# EAGLE design shield (EAGLE 7.2.0)
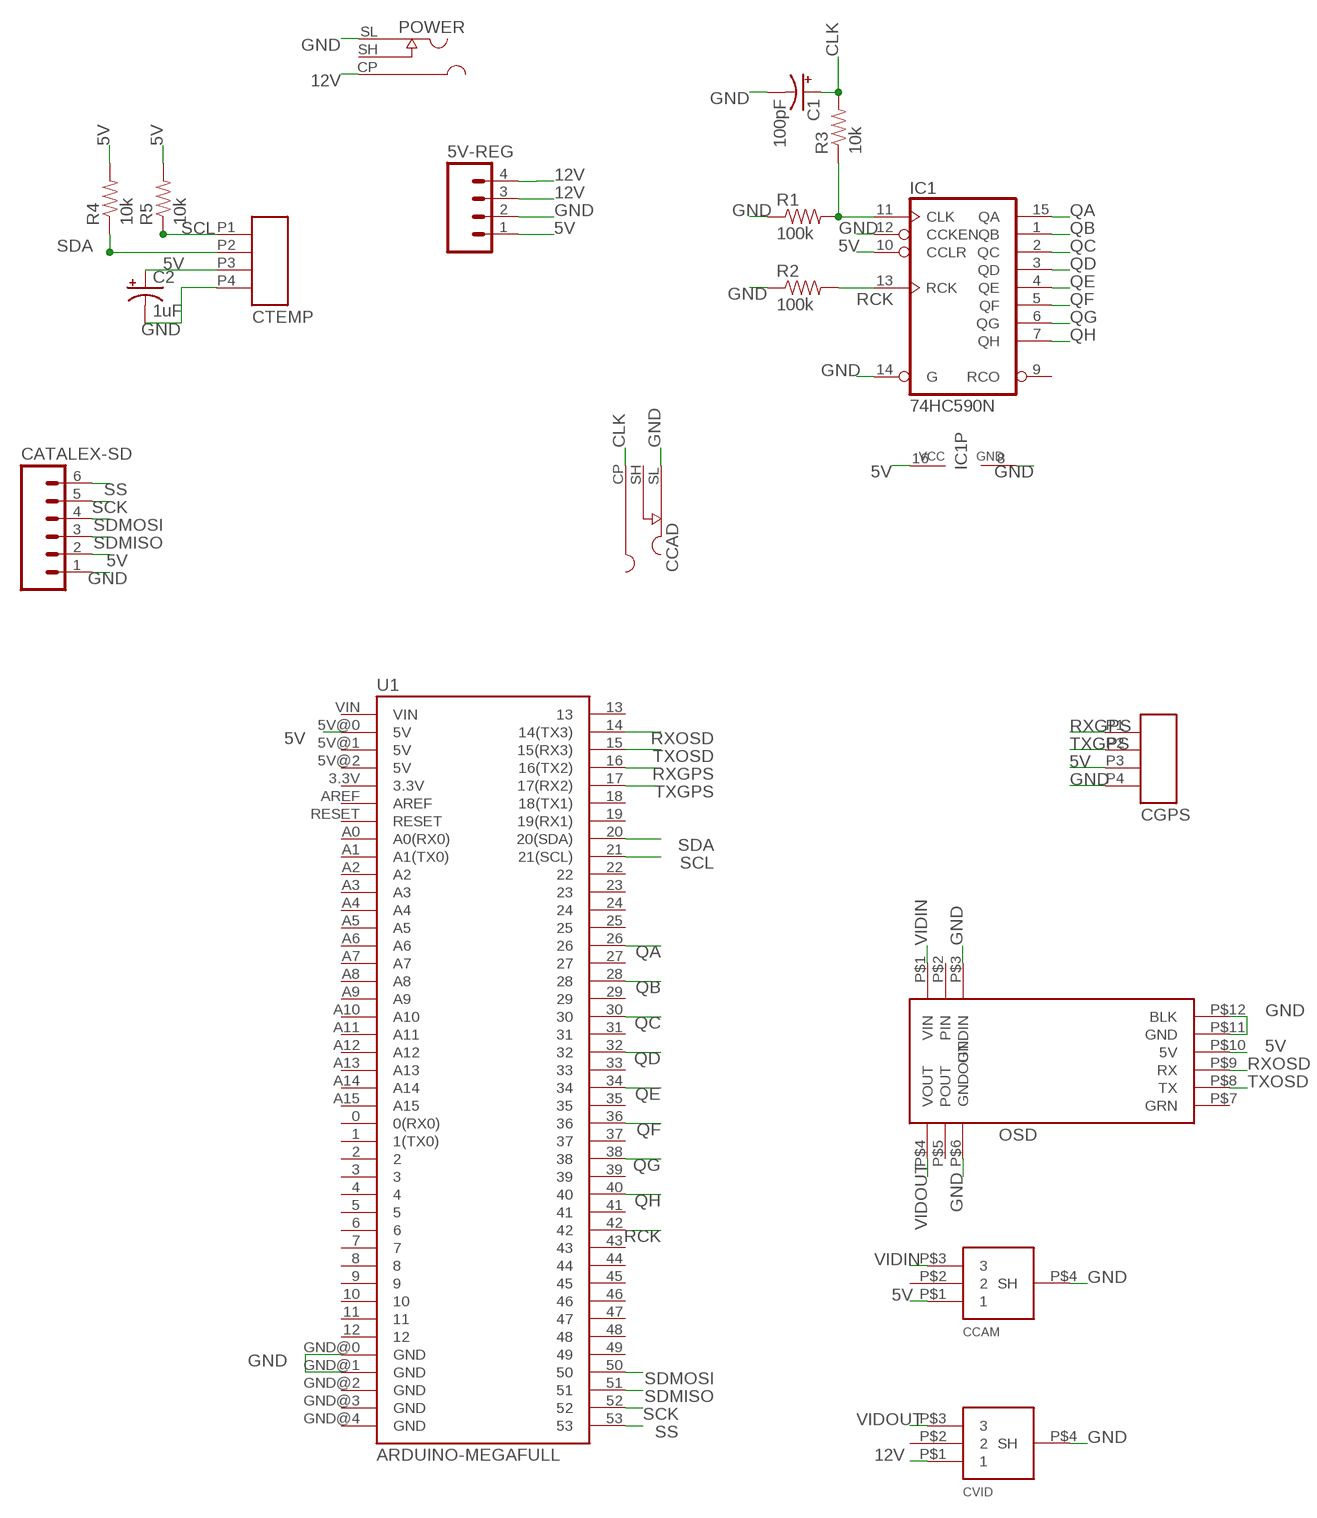
[diagram p0: schematic, sheet 1]

## Parts
5V-REG  M041.27MM  [1X04-1.27MM]
C1  100pF  10UF-25V-20%(PTH)KIT  [CPOL-RADIAL-10UF-25V-KIT]
C2  1uF  10UF-25V-20%(PTH)  [CPOL-RADIAL-10UF-25V]
CATALEX-SD  M06SILK_FEMALE_PTH  [1X06]
CCAD  L722RAS  [L722RAS]
CCAM  TRA3M  [TRA3M]
CGPS  TRAPC4MSX  [TRAPC4MSX]
CTEMP  TRAPC4MSX  [TRAPC4MSX]
CVID  TRA3M  [TRA3M]
IC1  74HC590N  [DIL16]
OSD  MINIM-OSD  [MINIM-OSD]
POWER  L722RAS  [L722RAS]
R1  100k  100KOHM-1/4W-5%(PTH)HORIZ-KIT  [AXIAL-0.3EZ]
R2  100k  100KOHM-1/4W-5%(PTH)HORIZ-KIT  [AXIAL-0.3EZ]
R3  10k  10KOHM-1/4W5%(PTH)HORIZ-KIT  [AXIAL-0.3EZ]
R4  10k  10KOHM-1/4W5%(PTH)HORIZ-KIT  [AXIAL-0.3EZ]
R5  10k  10KOHM-1/4W5%(PTH)HORIZ-KIT  [AXIAL-0.3EZ]
U1  ARDUINO-MEGAFULL  [ARDUINO_MEGA]

## Nets
5V: 5V-REG.1 C2.1(+) CATALEX-SD.2 CCAM.P$1 CGPS.P3 CTEMP.P3 IC1.10(CCLR) IC1.16(VCC) OSD.P$10(5V) R4.P$2 R5.P$2 U1.5V@0(5V)
12V: 5V-REG.3 5V-REG.4 CVID.P$1 POWER.CP(CENTRE)
CLK: C1.1(+) CCAD.CP(CENTRE) R3.P$2
GND: 5V-REG.2 C1.2(-) C2.2(-) CATALEX-SD.1 CCAD.SL(SLEEVE) CCAM.P$4(SH) CGPS.P4 CTEMP.P4 CVID.P$4(SH) IC1.8(GND) IC1.12(CCKEN) IC1.14(G) OSD.P$3(GNDIN) OSD.P$6(GNDOUT) OSD.P$11(GND) OSD.P$12(BLK) POWER.SL(SLEEVE) R1.P$1 R2.P$1 U1.GND@0(GND) U1.GND@1(GND)
N$1: IC1.11(CLK) R1.P$2 R3.P$1
QA: IC1.15(QA) U1.26
QB: IC1.1(QB) U1.28
QC: IC1.2(QC) U1.30
QD: IC1.3(QD) U1.32
QE: IC1.4(QE) U1.34
QF: IC1.5(QF) U1.36
QG: IC1.6(QG) U1.38
QH: IC1.7(QH) U1.40
RCK: IC1.13(RCK) R2.P$2 U1.42
RXGPS: CGPS.P1 U1.16(16(TX2))
RXOSD: OSD.P$9(RX) U1.14(14(TX3))
SCK: CATALEX-SD.5 U1.52
SCL: CTEMP.P1 R5.P$1 U1.21(21(SCL))
SDA: CTEMP.P2 R4.P$1 U1.20(20(SDA))
SDMISO: CATALEX-SD.3 U1.51
SDMOSI: CATALEX-SD.4 U1.50
SS: CATALEX-SD.6 U1.53
TXGPS: CGPS.P2 U1.17(17(RX2))
TXOSD: OSD.P$8(TX) U1.15(15(RX3))
VIDIN: CCAM.P$3 OSD.P$1(VIN)
VIDOUT: CVID.P$3 OSD.P$4(VOUT)
Unconnected: CCAD.SH(SHUNT) CCAM.P$2 CVID.P$2 IC1.9(RCO) OSD.P$2(PIN) OSD.P$5(POUT) OSD.P$7(GRN) POWER.SH(SHUNT) U1.0(0(RX0)) U1.1(1(TX0)) U1.2 U1.3 U1.3.3V U1.4 U1.5 U1.5V@1(5V) U1.5V@2(5V) U1.6 U1.7 U1.8 U1.9 U1.10 U1.11 U1.12 U1.13 U1.18(18(TX1)) U1.19(19(RX1)) U1.22 U1.23 U1.24 U1.25 U1.27 U1.29 U1.31 U1.33 U1.35 U1.37 U1.39 U1.41 U1.43 U1.44 U1.45 U1.46 U1.47 U1.48 U1.49 U1.A0(A0(RX0)) U1.A1(A1(TX0)) U1.A2 U1.A3 U1.A4 U1.A5 U1.A6 U1.A7 U1.A8 U1.A9 U1.A10 U1.A11 U1.A12 U1.A13 U1.A14 U1.A15 U1.AREF U1.GND@2(GND) U1.GND@3(GND) U1.GND@4(GND) U1.RESET U1.VIN

## Library data of the parts
5V-REG = SparkFun-Connectors:M04: Header 4 Standard 4-pin 0.1" header. Use with straight break away headers (SKU : PRT-00116), right angle break away headers (PRT-00553), swiss pins (PRT-00743), machine pins (PRT-00117), and female headers (PRT-00115). Molex polarized connector foot print use with SKU : PRT-08231 with associated crimp pins and housings. 1MM SMD Version SKU: PRT-10208
C1 C2 = SparkFun-Capacitors:10UF-25V-20%(PTH): CAP-08440; PROD_ID: CAP-08440
CATALEX-SD = SparkFun-Connectors:M06: Header 6 Standard 6-pin 0.1" header. Use with straight break away headers (SKU : PRT-00116), right angle break away headers (PRT-00553), swiss pins (PRT-00743), machine pins (PRT-00117), and female headers (PRT-00115). Molex polarized connector foot print use with SKU : PRT-08094 with associated crimp pins and housings. NOTES ON THE VARIANTS LOCK and LOCK_LONGPADS... This footprint was designed to help hold the alignment of a through-hole component (i.e. 6-pin header) while soldering it into place. You may notice that each hole has been shifted either up or down by 0.005 of an inch from it's more standard position (which is a perfectly straight line). This slight alteration caused the pins (the squares in the middle) to touch the edges of the holes. Because they are alternating, it causes a "brace" to hold the component in place. 0.005 has proven to be the perfect amount of "off-center" position when using our standard breakaway headers. Although looks a little odd when you look at the bare footprint, once you have a header in there, the alteration is very hard to notice. Also,if you push a header all the way into place, it is covered up entirely on the bottom side. This idea of altering the position of holes to aid alignment will be further integrated into the Sparkfun Library for other footprints. It can help hold any component with 3 or more connection pins.; PROD_ID: CONN-08437
CCAD POWER = custom-parts:L722RAS
CCAM CVID = custom-parts:TRA3M
CGPS CTEMP = custom-parts:TRAPC4MSX
IC1 = 74xx-eu:74*590: 8-bit binary COUNTER, output register
OSD = custom-parts:MINIM-OSD
R1 R2 = SparkFun-Resistors:100KOHM-1/4W-5%(PTH): RES-10686; PROD_ID: RES-10686
R3-R5 = SparkFun-Resistors:10KOHM-1/4W5%(PTH): RES-09435; PROD_ID: RES-9435
U1 = custom-parts:ARDUINO-MEGA: Arduino Mega board footprint

## Board
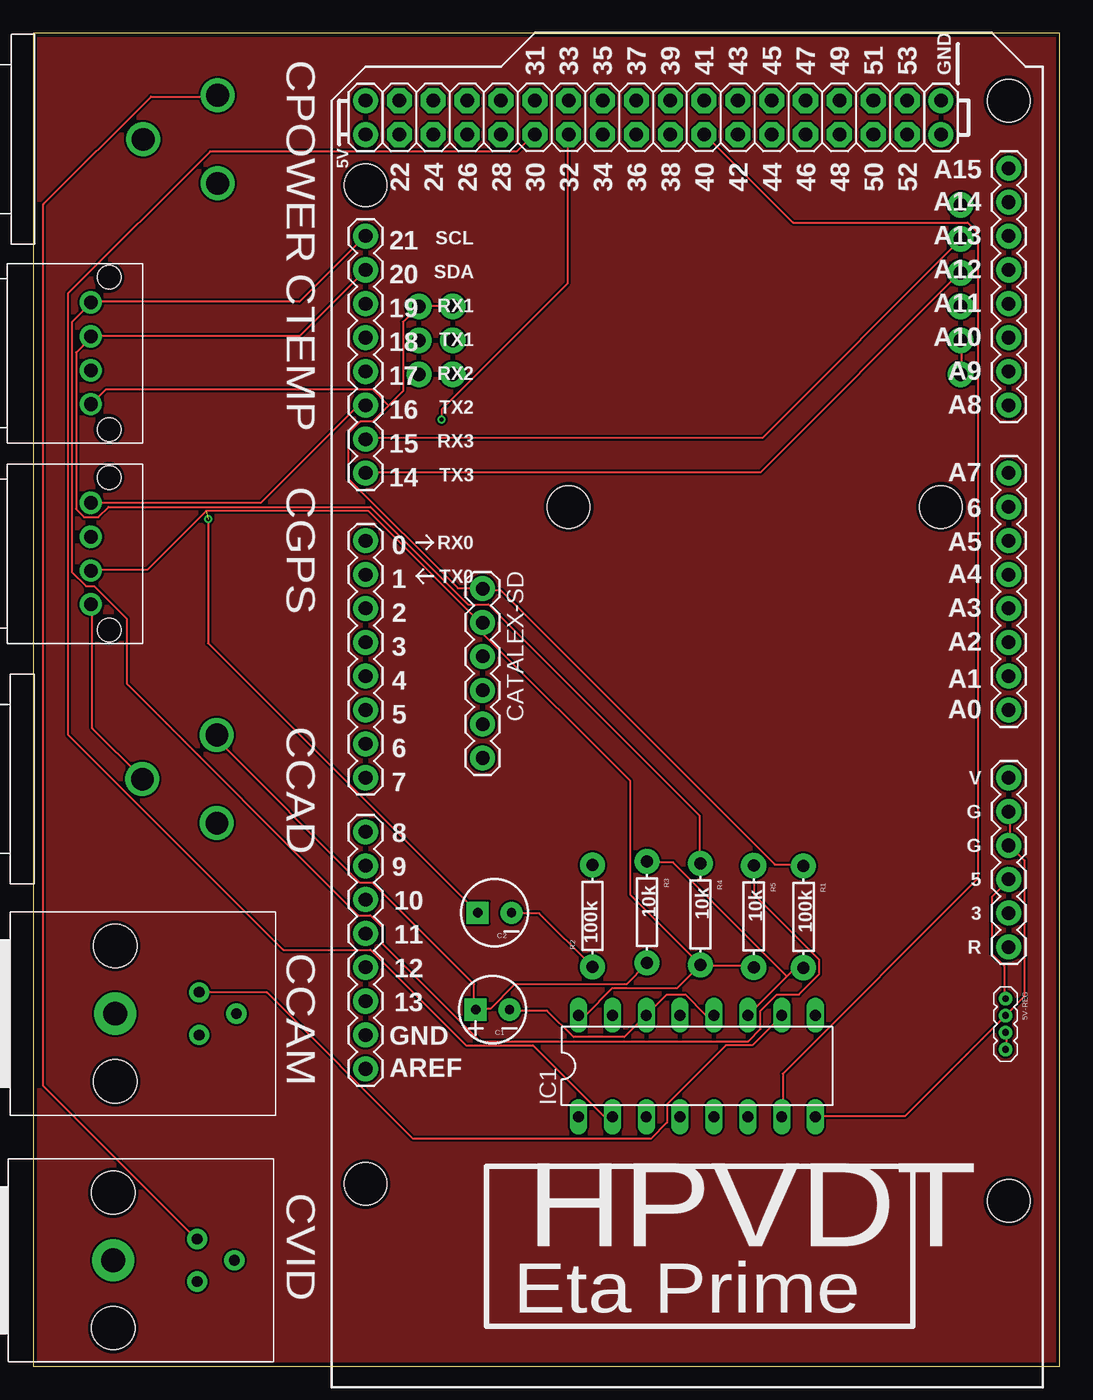
[diagram p1: board, top side]
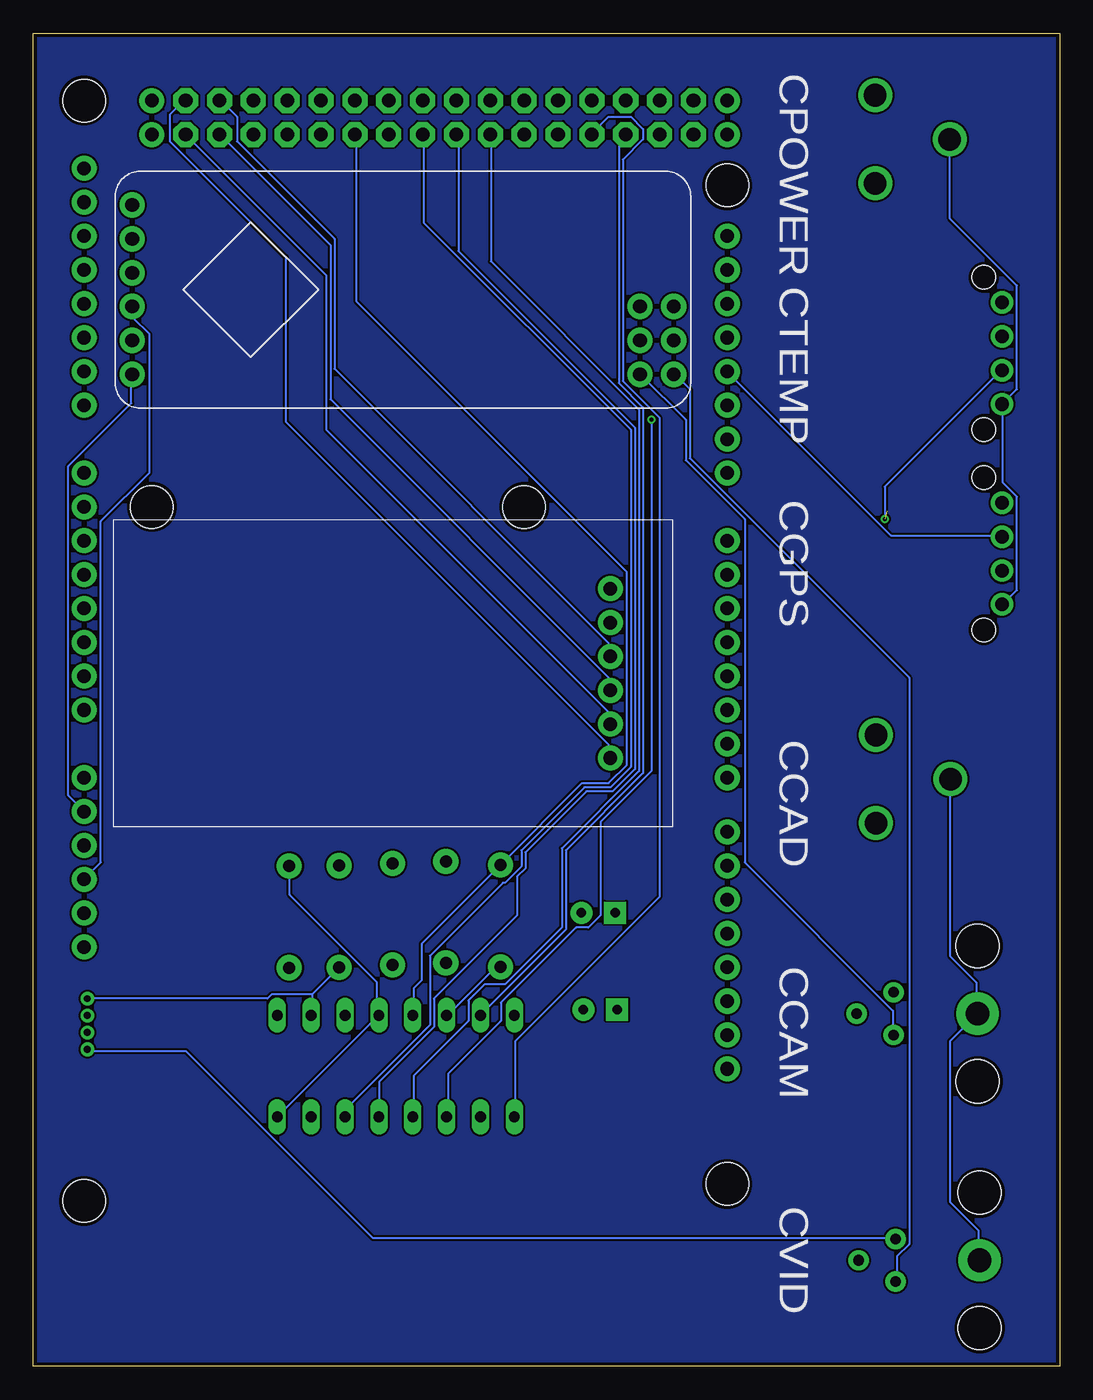
[diagram p2: board, bottom side, seen from below]

Size 77 x 100 mm. Coordinates in mm from the lower left corner, seen from the top.
Outline: 0,0 77,0 77,100 0,100 0,0
Copper layers (1*16): Top 0.035mm / dielectric 1.5mm / Bottom 0.035mm
Design rules "SeeedStudio_2layer_DRU_no_angle_20140221": minimum track width 6mil, minimum drill 12mil, track to track 6mil, track to pad 6mil, pad to pad 6mil, via to via 6mil, smd to smd 0mil, copper to edge 10mil, drill to drill 10mil, minimum pad ring 10mil, minimum via ring 6mil, stop-mask expansion 2mil, vias tented up to drill 100mil, thermal gap 10mil

### Footprints (pad centres in the part's own frame; a part is rotated, then mirrored left to right if it is on the bottom)
1X04-1.27MM = drill 0.508 pad 1: 1 0,0; 2 1.27,0; 3 2.54,0; 4 3.81,0
CPOL-RADIAL-10UF-25V-KIT = drill 0.7 pad 1.651 square: 1 1.27,0 | drill 0.7 pad 1.651: 2 -1.27,0
CPOL-RADIAL-10UF-25V = drill 0.7 pad 1.651 square: 1 1.27,0 | drill 0.7 pad 1.651: 2 -1.27,0
1X06 = drill 1.016 pad 1.88: 1 0,0; 2 2.54,0; 3 5.08,0; 4 7.62,0; 5 10.16,0; 6 12.7,0
L722RAS = drill 1.7: CP 5.588,3.302; SH 5.588,-3.302; SL 0,0
TRA3M = drill 0.8 pad 1.524: P$1 0,-1.6; P$2 -2.794,0; P$3 0,1.6 | drill 1.778 pad 3.175: P$4 6.299,0 | hole 3.251: 6.299,5.08; 6.299,-5.08
TRAPC4MSX = drill 1.016 pad 1.676: P1 3.81,0; P2 1.27,0; P3 -1.27,0; P4 -3.81,0 | hole 1.778: -5.715,-1.372; 5.715,-1.372
DIL16 = drill 0.813 long: 1 -8.89,-3.81; 2 -6.35,-3.81; 3 -3.81,-3.81; 4 -1.27,-3.81; 5 1.27,-3.81; 6 3.81,-3.81; 7 6.35,-3.81; 8 8.89,-3.81; 9 8.89,3.81; 10 6.35,3.81; 11 3.81,3.81; 12 1.27,3.81; 13 -1.27,3.81; 14 -3.81,3.81; 15 -6.35,3.81; 16 -8.89,3.81
MINIM-OSD = drill 1.016 pad 1.905: P$1 39.37,2.54; P$2 39.37,5.08; P$3 39.37,7.62; P$4 41.91,2.54; P$5 41.91,5.08; P$6 41.91,7.62; P$7 1.27,15.24; P$8 1.27,12.7; P$9 1.27,10.16; P$10 1.27,7.62; P$11 1.27,5.08; P$12 1.27,2.54
AXIAL-0.3EZ = drill 0.9 pad 1.88: P$1 -3.81,0; P$2 3.81,0
ARDUINO_MEGA = drill 1.016 pad 1.88: 0 63.5,50.8; 1 60.96,50.8; 2 58.42,50.8; 3 55.88,50.8; 3.3V 35.56,2.54; 4 53.34,50.8; 5 50.8,50.8; 5V@0 38.1,2.54; 5V@1 93.98,50.8; 5V@2 96.52,50.8; 6 48.26,50.8; 7 45.72,50.8; 8 41.656,50.8; 9 39.116,50.8; 10 36.576,50.8; 11 34.036,50.8; 12 31.496,50.8; 13 28.956,50.8; 14 68.58,50.8; 15 71.12,50.8; 16 73.66,50.8; 17 76.2,50.8; 18 78.74,50.8; 19 81.28,50.8; 20 83.82,50.8; 21 86.36,50.8; A0 50.8,2.54; A1 53.34,2.54; A2 55.88,2.54; A3 58.42,2.54; A4 60.96,2.54; A5 63.5,2.54; A6 66.04,2.54; A7 68.58,2.54; A8 73.66,2.54; A9 76.2,2.54; A10 78.74,2.54; A11 81.28,2.54; A12 83.82,2.54; A13 86.36,2.54; A14 88.9,2.54; A15 91.44,2.54; AREF 23.876,50.8; GND@0 40.64,2.54; GND@1 43.18,2.54; GND@2 93.98,7.62; GND@3 96.52,7.62; GND@4 26.416,50.8; RESET 33.02,2.54; VIN 45.72,2.54 | drill 1.016 pad 1.88 octagon: 22 93.98,48.26; 23 96.52,48.26; 24 93.98,45.72; 25 96.52,45.72; 26 93.98,43.18; 27 96.52,43.18; 28 93.98,40.64; 29 96.52,40.64; 30 93.98,38.1; 31 96.52,38.1; 32 93.98,35.56; 33 96.52,35.56; 34 93.98,33.02; 35 96.52,33.02; 36 93.98,30.48; 37 96.52,30.48; 38 93.98,27.94; 39 96.52,27.94; 40 93.98,25.4; 41 96.52,25.4; 42 93.98,22.86; 43 96.52,22.86; 44 93.98,20.32; 45 96.52,20.32; 46 93.98,17.78; 47 96.52,17.78; 48 93.98,15.24; 49 96.52,15.24; 50 93.98,12.7; 51 96.52,12.7; 52 93.98,10.16; 53 96.52,10.16 | hole 3.2: 15.24,50.8; 13.97,2.54; 66.04,35.56; 66.04,7.62; 90.17,50.8; 96.52,2.54

### Placement (x,y rotation side)
5V-REG  72.95,27.58 270 top
C1  34.46,26.75 180 top
C2  34.61,34.02 180 top
CATALEX-SD  33.71,58.33 270 top
CCAD  8.18,44.05 0 top
CCAM  12.44,26.45 180 top
CGPS  4.31,60.96 90 top
CTEMP  4.31,75.99 90 top
CVID  12.29,7.94 180 top
IC1  49.8,22.52 0 top
OSD  70.85,71.88 0 bottom
POWER  8.24,92.05 0 top
R1  57.79,33.71 270 top
R2  41.95,33.78 90 top
R3  46.05,34.06 270 top
R4  50.05,33.9 270 top
R5  54.05,33.74 270 top
U1  75.73,-1.57 90 top

### Tracks (layer width: path | path; a pad name or v marks a point on that pad's centre or on a via)
5V  (via drill 0.3)  (1 unrouted)
  Top 0.152: 5V-REG.1 72.85,27.58 72.85,30.02 71.93,30.94 71.93,35.2 73.15,36.42 U1.5V@0 | CGPS.P3 4.42,59.74 8.53,59.74 12.95,64.16 25.15,64.16 33.38,55.93 33.68,55.93 CATALEX-SD.2 33.83,55.78 33.83,54.86 44.81,43.89 44.81,35.36 49.99,30.18 R4.P$2 | IC1.16 41,26.36 41.45,26.36 43.43,28.35 48.31,28.35 49.99,30.02 R4.P$2 | CCAM.P$1 12.5,28.04 17.53,28.04 28.5,17.07 46.33,17.07 47.55,18.29 47.55,19.66 51.97,24.08 53.95,24.08 56.08,26.21 IC1.10 | R4.P$2 50.14,30.02 53.95,30.02 R5.P$2 | v13.11,63.55 13.11,54.25 33.22,34.14 C2.1
  Bottom 0.152: OSD.P$10 69.49,79.4 69.49,78.64 68.28,77.42 68.28,67.06 71.93,63.4 71.93,37.8 73.15,36.58 U1.5V@0 | 56.08,27.89 56.08,26.36 IC1.10 | 56.08,27.89 54.1,29.87 R5.P$2 | 56.08,27.89 59.13,27.89 59.44,27.58 72.85,27.58 5V-REG.1 | v13.11,63.55 13.11,65.99 4.42,74.68 CTEMP.P3
12V
  Top 0.152: 5V-REG.4 73,23.77 73,24.99 5V-REG.3 | POWER.CP 13.72,95.25 8.84,95.25 0.76,87.17 0.76,21.03 12.19,9.6 CVID.P$1
  Bottom 0.152: 5V-REG.4 72.85,23.62 65.53,23.62 51.51,9.6 12.34,9.6 CVID.P$1
CLK
  Top 0.152: R3.P$2 46.02,30.18 44.5,28.65 36.12,28.65 34.29,26.82 33.22,26.82 C1.1 33.07,26.82 33.07,28.65 25.45,36.27 24.54,36.27 13.87,46.94 13.87,47.24 CCAD.CP
GND
  Top 0.152: IC1.12 51.05,26.36 50.44,26.36 48.92,27.89 47.55,27.89 46.02,26.36 IC1.14 45.87,26.21 44.35,24.69 40.54,24.69 38.56,26.67 35.81,26.67 C1.2 | C2.2 35.97,33.98 37.95,33.98 41.91,30.02 R2.P$1 | OSD.P$12 69.65,74.52 69.65,76.81 OSD.P$11 | U1.GND@1 73.3,41.6 73.3,39.17 U1.GND@0 73.3,39.01 74.37,37.95 74.37,27.74 73,26.36 5V-REG.2 72.85,26.21 65.38,18.75 58.83,18.75 IC1.8 | 26.67,72.08 27.74,73.15 27.74,78.33 28.8,79.4 OSD.P$6 28.96,79.55 31.39,79.55 OSD.P$3 | 26.67,72.08 25.45,70.87 24.54,70.87 23.62,69.95 23.62,66.6 31.85,58.37 33.68,58.37 CATALEX-SD.1 33.83,58.22 35.05,58.22 55.63,37.64 57.76,37.64 R1.P$1 | CGPS.P4 4.42,57.15 4.42,47.85 8.08,44.2 CCAD.SL | 26.67,72.08 25.45,73.3 5.49,73.3 4.42,72.24 CTEMP.P4
  Bottom 0.152: IC1.14 45.87,26.36 42.37,29.87 42.06,29.87 R2.P$1 | IC1.8 58.67,18.75 51.21,26.21 IC1.12 51.21,26.36 51.21,28.8 57.76,35.36 57.76,37.49 R1.P$1 | OSD.P$12 69.65,74.37 69.65,72.24 74.37,67.51 74.37,42.82 73.3,41.76 U1.GND@1 | CVID.P$4 6.1,8.08 6.1,10.21 8.23,12.34 8.23,24.38 6.25,26.36 CCAM.P$4 6.25,26.52 6.25,28.8 8.23,30.79 8.23,44.04 CCAD.SL | CGPS.P4 4.27,57.15 3.2,58.22 3.2,65.23 4.27,66.29 4.27,72.08 CTEMP.P4 4.27,72.24 3.2,73.3 3.2,81.08 8.23,86.11 POWER.SL
N$1
  Top 0.152: 56.54,29.26 57.15,29.87 57.76,29.87 R1.P$2 | 56.54,29.26 53.65,26.36 IC1.11 | 56.54,29.26 48.01,37.8 46.18,37.8 R3.P$1
N$2
  pour Bottom: 0,0 77,0 77,100 0,100
N$3
  pour Top: 0,0 77,0 77,100 0,100
QA
  Bottom 0.152: IC1.15 43.43,26.36 37.03,32.77 37.03,38.71 31.24,44.5 31.24,71.93 33.07,73.76 33.07,91.9 32.61,92.35 U1.26
QB
  Bottom 0.152: IC1.1 40.84,18.75 40.84,24.38 30.02,35.2 30.02,71.17 32.77,73.91 32.77,90.53 31.24,92.05 31.24,92.81 32.16,93.73 33.83,93.73 35.05,92.51 U1.28
QC
  Top 0.152: IC1.2 43.43,18.75 42.82,18.75 37.49,24.08 32.46,24.08 25.3,31.24 18.75,31.24 2.59,47.4 2.59,80.47 13.26,91.14 36.27,91.14 37.49,92.35 U1.30
QD  (via drill 0.3)
  Top 0.152: v30.63,71.02 30.63,71.78 40.08,81.23 40.08,92.35 U1.32
  Bottom 0.152: v30.63,71.02 30.63,44.65 34.44,40.84 34.44,33.83 35.36,32.92 36.27,32.92 41.91,27.28 41.91,25.91 45.87,21.95 45.87,18.75 IC1.3
QE
  Bottom 0.152: IC1.4 48.46,18.75 48.46,21.79 44.35,25.91 44.35,27.43 43.13,28.65 41.6,28.65 37.34,32.92 37.34,38.86 31.55,44.65 31.55,71.78 42.67,82.91 42.67,92.35 U1.34
QF
  Bottom 0.152: IC1.5 51.05,18.75 51.05,21.34 46.94,25.45 46.94,27.58 40.69,33.83 40.69,36.73 40.08,37.34 40.08,38.56 35.51,43.13 33.53,43.13 31.85,44.81 31.85,70.41 45.11,83.67 45.11,92.35 U1.36
QG
  Bottom 0.152: IC1.6 53.49,18.75 53.49,19.36 47.24,25.6 47.24,30.79 41.76,36.27 41.6,36.27 40.39,37.49 40.39,38.71 35.66,43.43 33.68,43.43 32.16,44.96 32.16,70.26 47.7,85.8 47.7,92.35 U1.38
QH
  Top 0.152: IC1.7 56.24,18.75 56.24,21.95 70.87,36.58 70.87,85.04 70.1,85.8 57,85.8 50.44,92.35 U1.40
RCK
  Bottom 0.152: IC1.13 48.46,26.36 48.46,28.35 47.85,28.96 47.85,31.7 42.06,37.49 R2.P$2 41.91,37.64 35.81,43.74 33.83,43.74 32.46,45.11 32.46,59.59 52.73,79.86 52.73,92.35 U1.42
RXGPS
  Top 0.152: CGPS.P1 17.07,64.77 24.38,72.08 24.84,72.08 U1.16
RXOSD
  Top 0.152: U1.14 24.99,67.06 54.56,67.06 69.49,81.99 OSD.P$9
SCK
  Bottom 0.152: CATALEX-SD.5 33.83,48.31 33.83,49.07 55.02,70.26 55.02,81.84 65.53,92.35 U1.52
SCL
  Top 0.152: U1.21 24.84,84.73 19.96,79.86 4.42,79.86 CTEMP.P1 4.27,79.7 2.9,78.33 2.9,59.59 3.96,58.52 4.57,58.52 7.01,56.08 7.01,51.21 24.38,33.83 25.3,33.83 26.21,32.92 26.21,31.7 33.53,24.38 53.65,24.38 54.56,25.3 54.56,26.67 55.78,27.89 57.45,27.89 58.98,29.41 58.98,30.48 54.1,35.36 54.1,37.49 R5.P$1
SDA
  Top 0.152: U1.20 24.84,82.14 19.96,77.27 4.42,77.27 CTEMP.P2 4.27,77.11 3.2,76.05 3.2,64.31 3.81,63.7 4.88,63.7 5.64,64.47 25.3,64.47 32.61,57.15 34.14,57.15 49.99,41.3 49.99,37.8 R4.P$1
SDMISO
  Bottom 0.152: CATALEX-SD.3 33.83,53.34 33.83,54.25 54.41,74.83 54.41,84.58 61.72,91.9 61.72,93.73 62.94,94.94 U1.51
SDMOSI
  Bottom 0.152: CATALEX-SD.4 33.83,50.75 33.83,51.66 54.71,72.54 54.71,84.12 62.94,92.35 U1.50
SS
  Bottom 0.152: CATALEX-SD.6 33.83,45.72 33.83,46.63 58.06,70.87 58.06,83.21 66.75,91.9 66.75,93.88 65.68,94.94 U1.53
TXGPS
  Bottom 0.152: CGPS.P2 4.42,62.33 12.65,62.33 24.84,74.52 U1.17
TXOSD
  Top 0.152: U1.15 24.99,69.65 54.71,69.65 69.49,84.43 OSD.P$8
VIDIN
  Bottom 0.152: CCAM.P$3 12.5,24.99 12.5,26.67 23.62,37.8 23.62,63.55 28.04,67.97 28.04,71.02 31.39,74.37 OSD.P$1
VIDOUT
  Bottom 0.152: CVID.P$3 12.19,6.4 12.19,8.23 11.28,9.14 11.28,51.66 27.74,68.12 27.74,73.3 28.8,74.37 OSD.P$4

### Text on the board
tPlace: CPOWER | CTEMP | CGPS | CCAD | CCAM | CVID | HPVDT | Eta Prime
bPlace: CPOWER | CTEMP | CGPS | CCAD | CCAM | CVID
tOrigins: OSD